# EAGLE schematic output stage and VCA v2 (EAGLE 9.5.2)
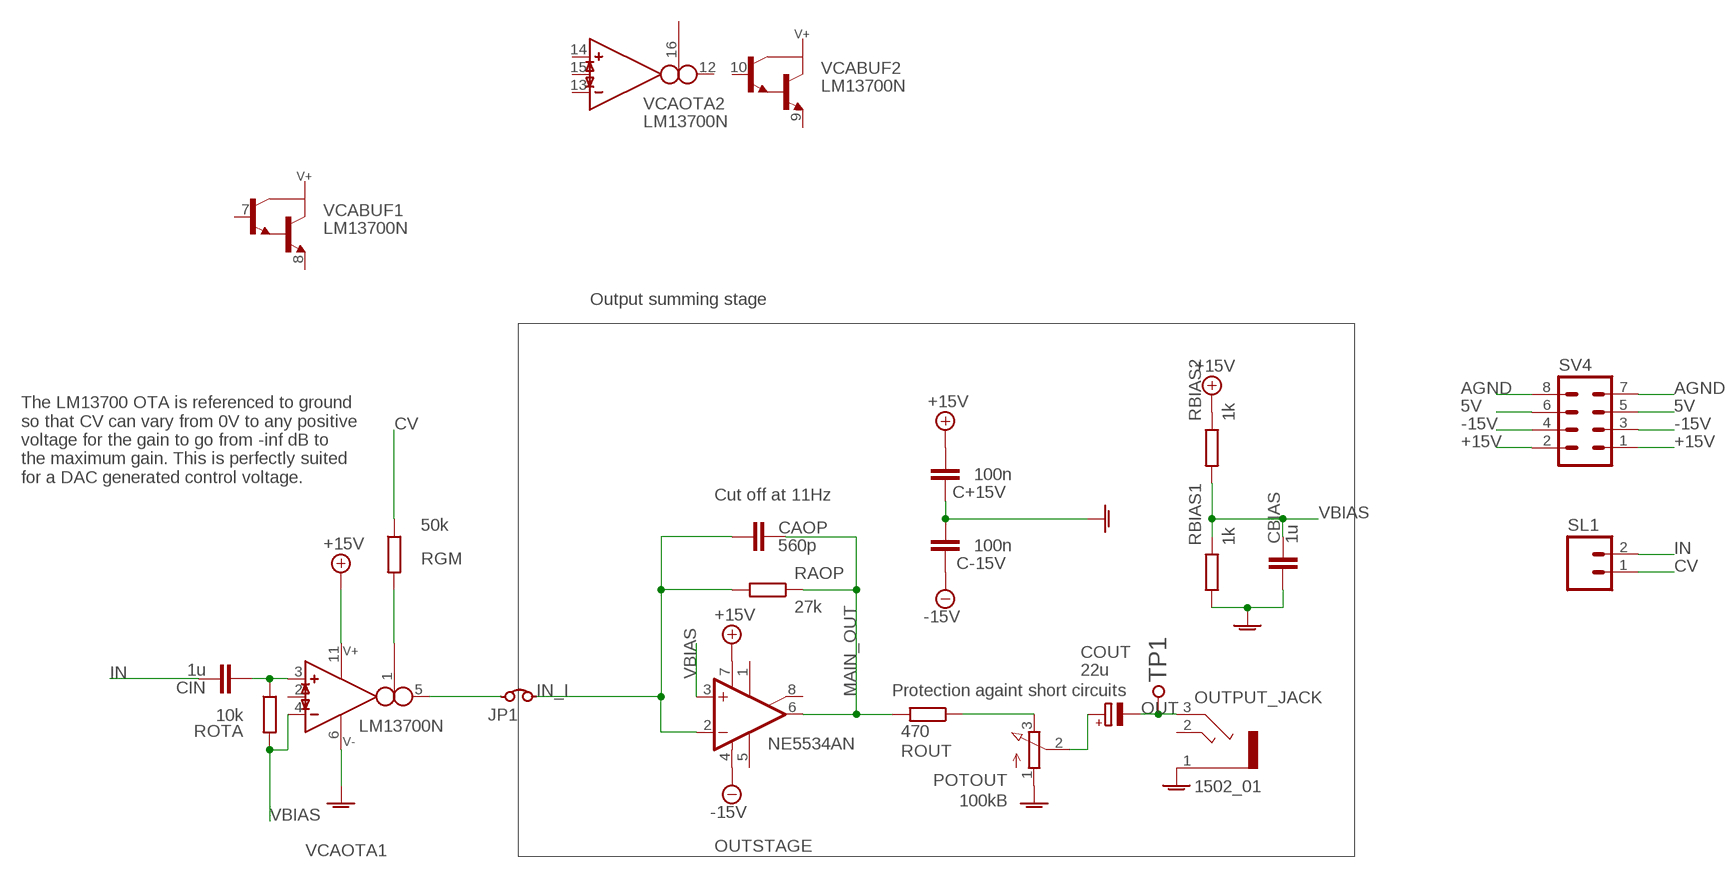
[diagram p0: schematic, sheet 1]

## Parts
C+15V  100n  C-EU050-030X075  [C050-030X075]
C-15V  100n  C-EU050-030X075  [C050-030X075]
CAOP  560p  C-EU050-030X075  [C050-030X075]
CBIAS  1u  C-EU050-030X075  [C050-030X075]
CIN  1u  C-EU050-030X075  [C050-030X075]
COUT  22u  CPOL-EUB45181B  [B45181B]
JP1  JUMPER  [HDR2X1]
OUTPUT_JACK  1502_01  [1502_01]
OUTSTAGE  NE5534AN  [DIL08]
POTOUT  100kB  3RP/1610N  [3RP/1610N]
RAOP  27k  R-EU_0204/7  [0204/7]
RBIAS1  1k  R-EU_0204/7  [0204/7]
RBIAS2  1k  R-EU_0204/7  [0204/7]
RGM  50k  R-EU_0204/7  [0204/7]
ROTA  10k  R-EU_0204/7  [0204/7]
ROUT  470  R-EU_0204/7  [0204/7]
SL1  MA02  [02PA]
SV4  MA04-2  [MA04-2]
TP1  TESTPOINT  [TESTPOINT_63]
VCA  LM13700N  [DIL16]

## Nets
5V: SV4.5 SV4.6
+15V: C+15V.2 OUTSTAGE.7(V+) RBIAS2.1 SV4.1 SV4.2 VCA.11(SUPPLY:V+)
-15V: C-15V.1 OUTSTAGE.4(V-) SV4.3 SV4.4
AGND: C+15V.1 C-15V.2 CBIAS.2 OUTPUT_JACK.1 POTOUT.1(A) RBIAS1.2 SV4.7 SV4.8 VCA.6(SUPPLY:V-)
CV: RGM.1 SL1.1
IN: CIN.1 SL1.2
IN_I: CAOP.2 JP1.2 OUTSTAGE.2(-IN) RAOP.2
MAIN_OUT: CAOP.1 OUTSTAGE.6(OUT) RAOP.1 ROUT.2
N$5: JP1.1 VCA.5(OTA1:OUT)
N$6: RGM.2 VCA.1(OTA1:I_BIAS)
N$7: CIN.2 ROTA.1 VCA.3(OTA1:IN_P)
N$8: COUT.+ POTOUT.2(S)
N$9: POTOUT.3(E) ROUT.1
OUT: COUT.- OUTPUT_JACK.3 TP1.P$1
VBIAS: CBIAS.1 OUTSTAGE.3(+IN) RBIAS1.1 RBIAS2.2 ROTA.2 VCA.4(OTA1:IN_N)
Unconnected: OUTPUT_JACK.2 OUTSTAGE.1(ON) OUTSTAGE.5(CMP) OUTSTAGE.8(ON/CMP) VCA.2(OTA1:I_DIODE) VCA.7(BUF1:B) VCA.8(BUF1:E) VCA.9(BUF2:E) VCA.10(BUF2:B) VCA.12(OTA2:OUT) VCA.13(OTA2:IN_N) VCA.14(OTA2:IN_P) VCA.15(OTA2:I_DIODE) VCA.16(OTA2:I_BIAS)

## Notes on the sheet
- Output summing stage
- The LM13700 OTA is referenced to ground 
  so that CV can vary from 0V to any positive 
  voltage for the gain to go from -inf dB to 
  the maximum gain. This is perfectly suited 
  for a DAC generated control voltage.
- Cut off at 11Hz
- Protection againt short circuits

## Library data of the parts
C+15V C-15V CAOP CBIAS CIN = rcl:C-EU: CAPACITOR, European symbol; SPICEPREFIX: C
COUT = resistor:CPOL-EU: POLARIZED CAPACITOR, European symbol
JP1 = 6P1_EVB:JUMPER: Wire jumper .1" C
OUTPUT_JACK = con-lumberg:1502_01: Jack connectors according to JISC 6560, 3.5 mm Klinkensteckverbinder nach JISC 6560, 3,5 mm Source: http://www.lumberg.com/Produkte/PDFs/1502_01.pdf; OC_FARNELL: 4739747; OC_NEWARK: unknown
OUTSTAGE = linear:NE5534: LOW-NOISE OPERATIONAL AMPLIFIER Source: http://focus.ti.com/lit/ds/symlink/ne5534.pdf
POTOUT = pot:3RP/1610N: 16mm Potentiometer one level Source: http://www.alphapotentiometers.net/html/16mm_pot_2.html
RAOP RBIAS1 RBIAS2 RGM ROTA ROUT = rcl:R-EU_: RESISTOR, European symbol; SPICEPREFIX: R
SL1 = con-amp-quick:MA02: AMP QUICK CONNECTOR; OC_FARNELL: unknown; OC_NEWARK: unknown
SV4 = con-lstb:MA04-2: PIN HEADER; OC_FARNELL: unknown; OC_NEWARK: unknown
TP1 = 6P1_EVB:TESTPOINT
VCA = ota:LM13700: Dual OTA with buffers